# Altium schematic sheet 16-MT7688AN Power-F.SchDoc
size A4
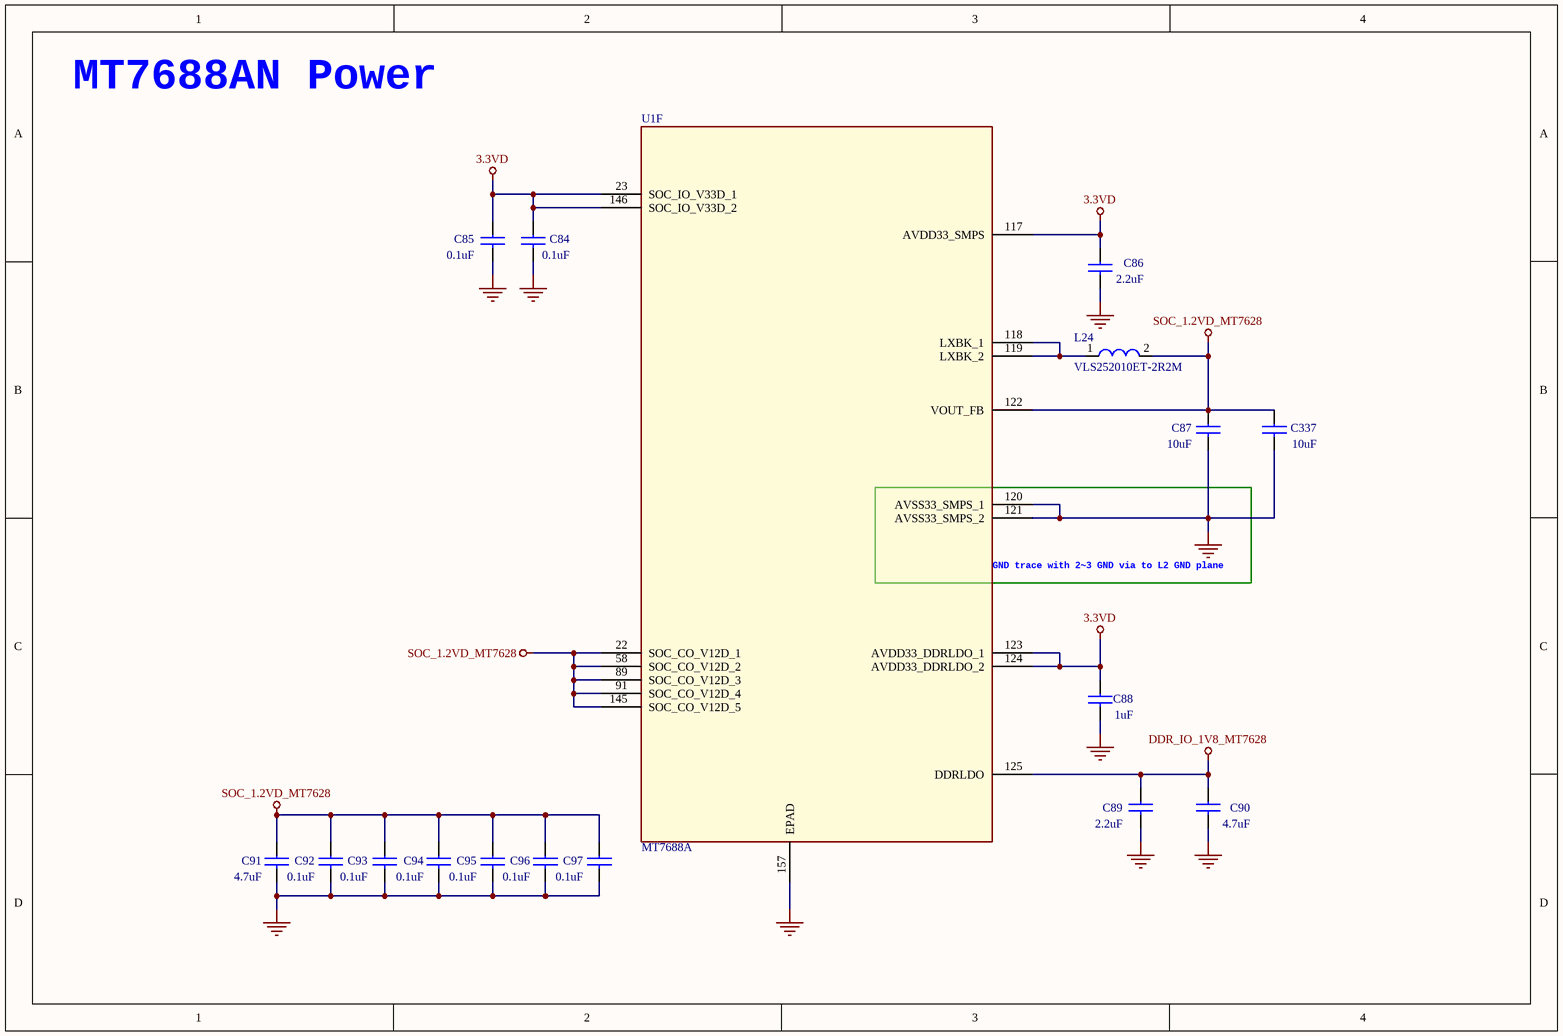
[diagram p0: 16-MT7688AN Power-F.SchDoc]

## Parts
C84  0.1uF  [RLC 0201 M35]
C85  0.1uF  [RLC 0201 M35]
C86  2.2uF  [RLC 0402 M35]
C87  10uF  [RLC 0402 M35]
C88  1uF  [RLC 0201 M35]
C89  2.2uF  [RLC 0402 M35]
C90  4.7uF  [RLC 0402 M35]
C91  4.7uF  [RLC 0402 M35]
C92  0.1uF  [RLC 0201 M35]
C93  0.1uF  [RLC 0201 M35]
C94  0.1uF  [RLC 0201 M35]
C95  0.1uF  [RLC 0201 M35]
C96  0.1uF  [RLC 0201 M35]
C97  0.1uF  [RLC 0201 M35]
C337  10uF  [RLC 0402 M35]
L24  VLS252010ET-2R2M  [L/IND/SMD/VLS252010/TDK]
U1  MT7688A  [MT7628AN$2F$DRQFN156$2F$SMD$2F$P0.5$2F$12X12]  (part F of 6)

## Nets
3.3VD: C84.1 C85.1 C86.1 C88.1 U1.23(SOC_IO_V33D_1) U1.117(AVDD33_SMPS) U1.123(AVDD33_DDRLDO_1) U1.124(AVDD33_DDRLDO_2) U1.146(SOC_IO_V33D_2)
DDR_IO_1V8_MT7628: C89.1 C90.1 U1.125(DDRLDO)
GND: C84.2 C85.2 C86.2 C87.2 C88.2 C89.2 C90.2 C91.2 C92.2 C93.2 C94.2 C95.2 C96.2 C97.2 C337.2 U1.120(AVSS33_SMPS_1) U1.121(AVSS33_SMPS_2) U1.157(EPAD)
SOC_1.2VD_MT7628: C87.1 C91.1 C92.1 C93.1 C94.1 C95.1 C96.1 C97.1 C337.1 L24.2 U1.22(SOC_CO_V12D_1) U1.58(SOC_CO_V12D_2) U1.89(SOC_CO_V12D_3) U1.91(SOC_CO_V12D_4) U1.122(VOUT_FB) U1.145(SOC_CO_V12D_5)
NetL24_1: L24.1 U1.118(LXBK_1) U1.119(LXBK_2)

## Notes on the sheet
- MT7688AN Power
- (near U1) GND trace with 2~3 GND via to L2 GND plane

## Library data of the parts
C84-C97 C337 = CAP NP
L24 = L/0402: IND 0805 METAL 2.2uH 0.19R 1.2A T=1.0mm
U1 = MT7620N-n_26